# Altium schematic sheet Total.SchDoc: USRP Cellular Tranceiver
size A3; Revision: 1; SheetNumber: 1; DocumentName: Fairwaves Co.
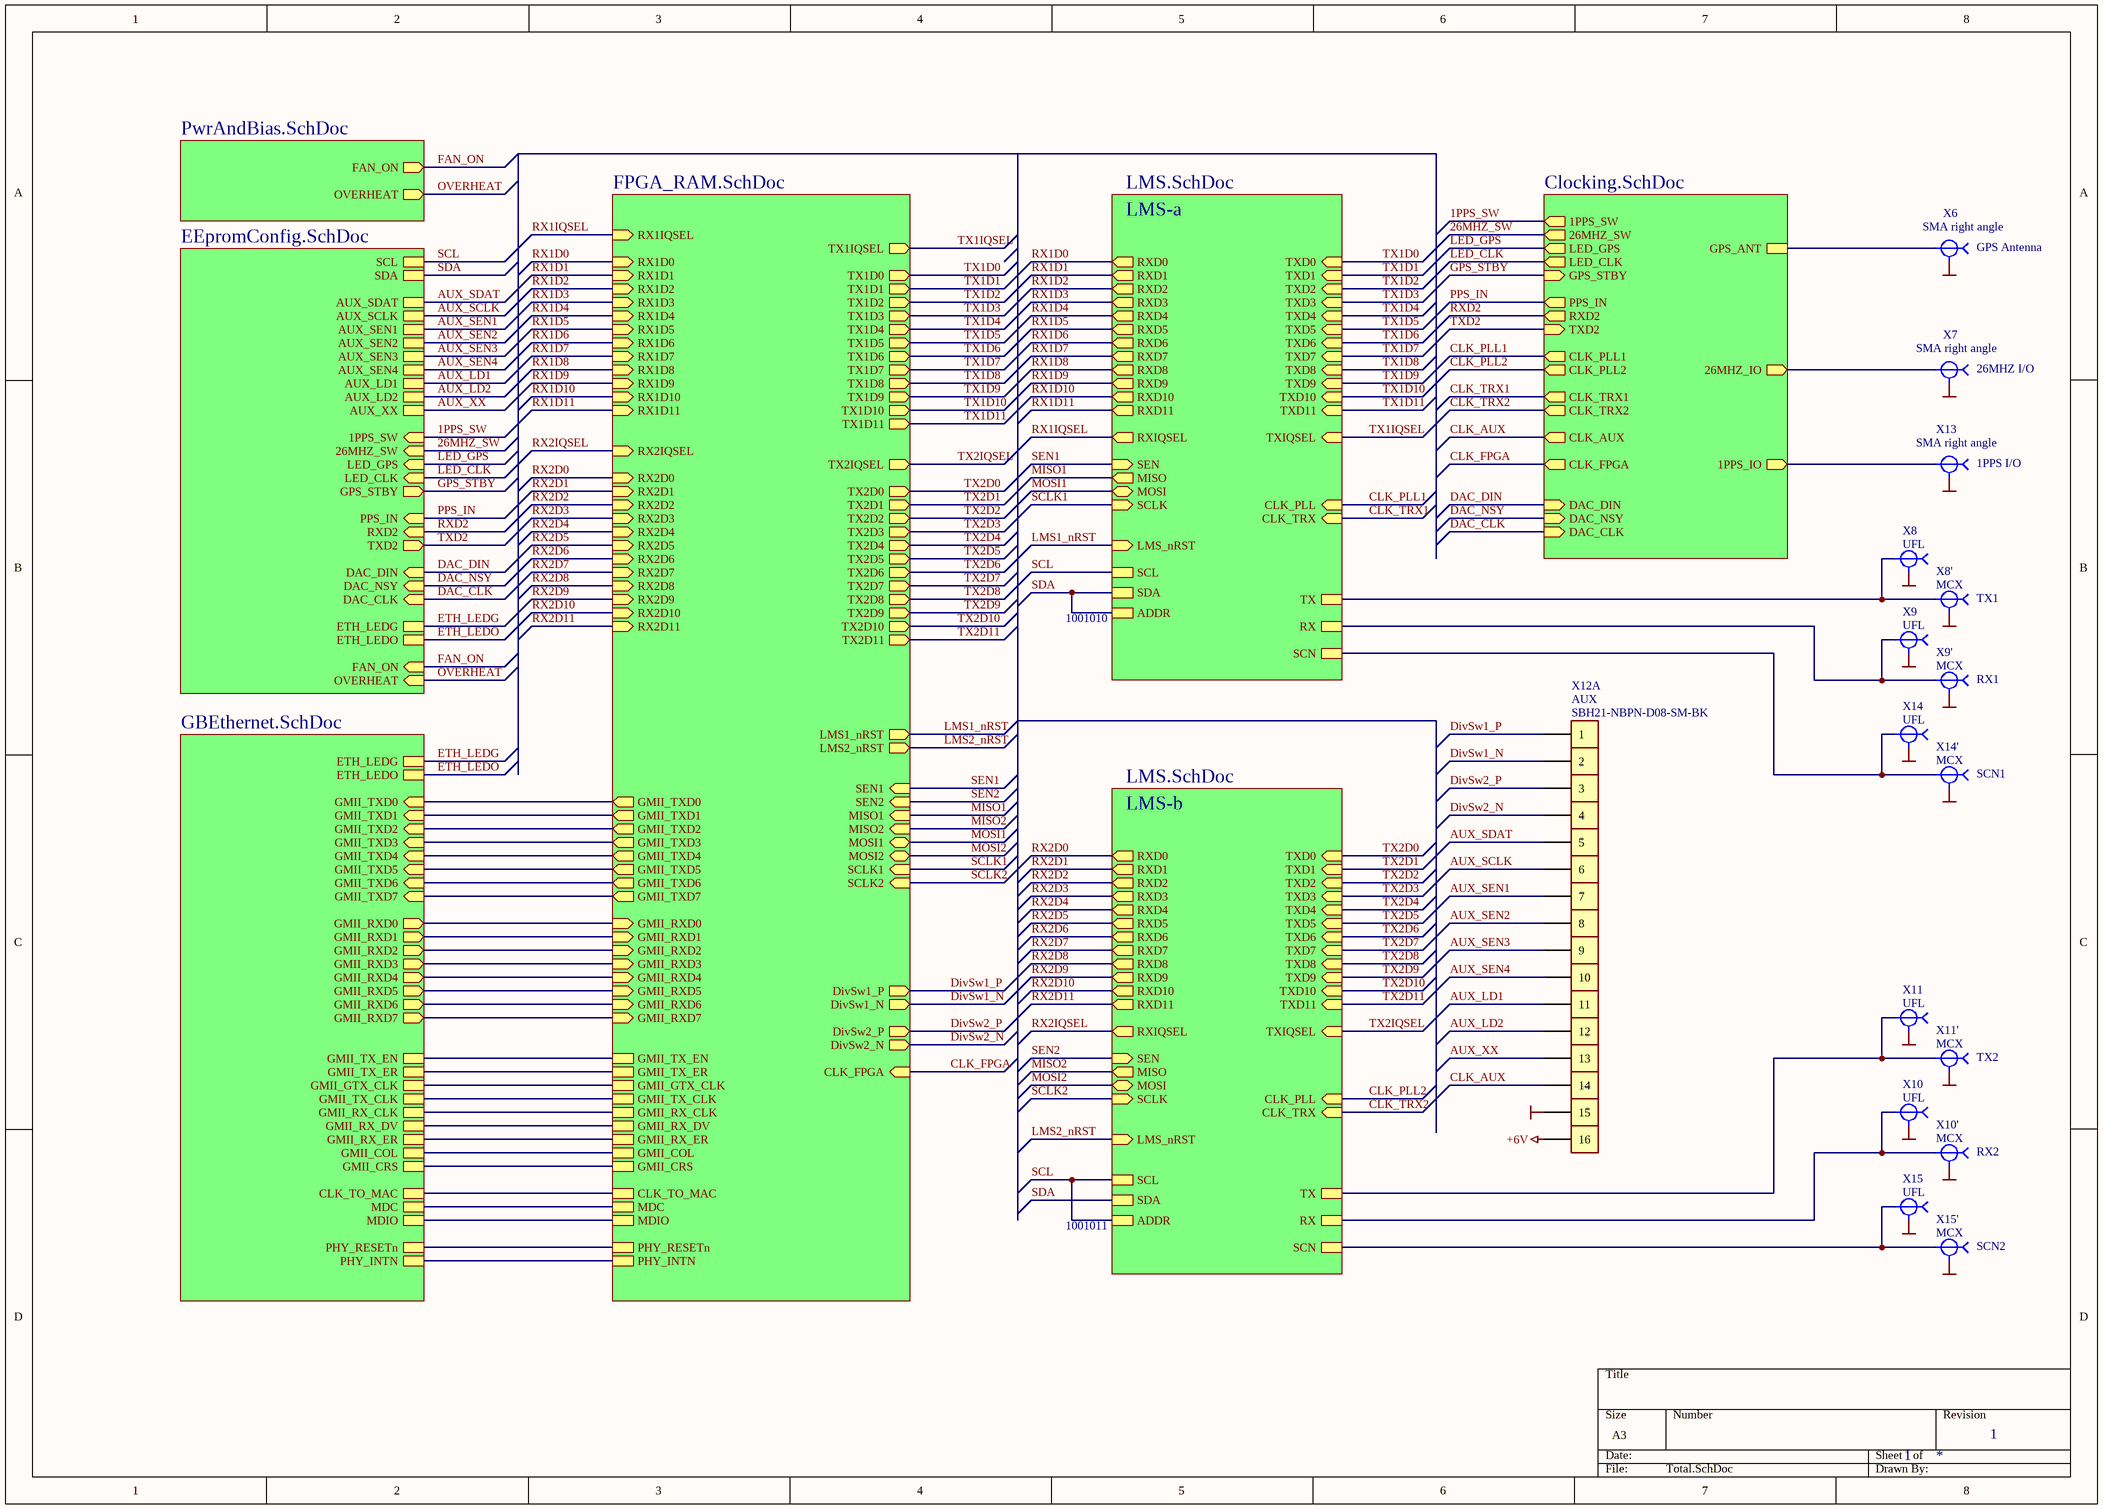
[diagram p0: Total.SchDoc]

## Parts
X6  SMA right angle  Description: GPS Antenna  [SMA right angle]
X7  SMA right angle  Description: 26MHZ I/O  [SMA right angle]
X8  UFL  [U_FL]
X8'  MCX  Discription: TX1  [ML 120]
X9  UFL  [U_FL]
X9'  MCX  Discription: RX1  [ML 120]
X10  UFL  [U_FL]
X10'  MCX  Discription: RX2  [ML 120]
X11  UFL  [U_FL]
X11'  MCX  Discription: TX2  [ML 120]
X12  SBH21-NBPN-D08-SM-BK  Misc: AUX  [SBH-16]  (parts A,B,C,D,E,F,G,H,I,J,K,L,M,N,O,P of 16)
X13  SMA right angle  Description: 1PPS I/O  [SMA right angle]
X14  UFL  [U_FL]
X14'  MCX  Discription: SCN1  [ML 120]
X15  UFL  [U_FL]
X15'  MCX  Discription: SCN2  [ML 120]

## Sub-sheets
Clocking = Clocking.SchDoc: TXD2 (in), 26MHZ_IO (out), CLK_FPGA (out), CLK_TRX1 (out), GPS_ANT, DAC_DIN (in), DAC_NSY (in), DAC_CLK (in), PPS_IN (out), RXD2 (out), CLK_PLL1 (out), CLK_AUX (out), 1PPS_IO (out), CLK_PLL2 (out), CLK_TRX2 (out), 1PPS_SW (out), 26MHZ_SW (out), LED_GPS (out), LED_CLK (out), GPS_STBY (in)
EEpromConfig = EEpromConfig.SchDoc: PPS_IN (in), DAC_DIN (in), DAC_NSY (in), DAC_CLK (in), TXD2 (out), RXD2 (in), ETH_LEDG, ETH_LEDO, FAN_ON (in), OVERHEAT (in), AUX_SDAT, AUX_SCLK, AUX_SEN1, AUX_LD1, AUX_XX, AUX_SEN2, AUX_LD2, 1PPS_SW (in), 26MHZ_SW (in), LED_GPS (in), LED_CLK (in), AUX_SEN3, AUX_SEN4, GPS_STBY (out), SCL, SDA
FPGA_RAM = FPGA_RAM.SchDoc: DivSw1_P (out), DivSw1_N (out), TX1IQSEL (out), TX2IQSEL (out), RX1IQSEL (in), RX2IQSEL (in), SEN1 (in), SEN2 (in), MISO1 (in), MOSI1 (bidir), SCLK1 (in), DivSw2_P (out), DivSw2_N (out), CLK_FPGA (in), CLK_TO_MAC, GMII_TX_EN, GMII_TX_ER, GMII_GTX_CLK, GMII_TX_CLK, GMII_RX_CLK, GMII_RX_DV, GMII_RX_ER, GMII_COL, GMII_CRS, MDIO, MDC, PHY_INTN, PHY_RESETn, MISO2 (in), MOSI2 (bidir), SCLK2 (in), LMS1_nRST (out), LMS2_nRST (out), TX1D0 (out), TX1D1 (out), TX1D2 (out), TX1D3 (out), TX1D4 (out), TX1D5 (out), TX1D6 (out), TX1D7 (out), TX1D8 (out), TX1D9 (out), TX1D10 (out), TX1D11 (out), TX2D0 (out), TX2D1 (out), TX2D2 (out), TX2D3 (out), TX2D4 (out), TX2D5 (out), TX2D6 (out), TX2D7 (out), TX2D8 (out), TX2D9 (out), TX2D10 (out), TX2D11 (out), RX1D0 (in), RX1D1 (in), RX1D2 (in), RX1D3 (in), RX1D4 (in), RX1D5 (in), RX1D6 (in), RX1D7 (in), RX1D8 (in), RX1D9 (in), RX1D10 (in), RX1D11 (in), RX2D0 (in), RX2D1 (in), RX2D2 (in), RX2D3 (in), RX2D4 (in), RX2D5 (in), RX2D6 (in), RX2D7 (in), RX2D8 (in), RX2D9 (in), RX2D10 (in), RX2D11 (in), GMII_TXD0 (out), GMII_TXD1 (out), GMII_TXD2 (out), GMII_TXD3 (out), GMII_TXD4 (out), GMII_TXD5 (out), GMII_TXD6 (out), GMII_TXD7 (out), GMII_RXD0 (in), GMII_RXD1 (in), GMII_RXD2 (in), GMII_RXD3 (in), GMII_RXD4 (in), GMII_RXD5 (in), GMII_RXD6 (in), GMII_RXD7 (in)
GBEthernet = GBEthernet.SchDoc: CLK_TO_MAC, GMII_TX_ER, GMII_TX_EN, GMII_GTX_CLK, GMII_RX_CLK, GMII_TX_CLK, GMII_RX_DV, GMII_RX_ER, GMII_COL, GMII_CRS, MDC, MDIO, PHY_INTN, PHY_RESETn, ETH_LEDG, GMII_TXD0 (in), GMII_TXD1 (in), GMII_TXD2 (in), GMII_TXD3 (in), GMII_TXD4 (in), GMII_TXD5 (in), GMII_TXD6 (in), GMII_TXD7 (in), GMII_RXD0 (out), GMII_RXD1 (out), GMII_RXD2 (out), GMII_RXD3 (out), GMII_RXD4 (out), GMII_RXD5 (out), GMII_RXD6 (out), GMII_RXD7 (out), ETH_LEDO
LMS-a = LMS.SchDoc: RXD0 (out), RXIQSEL (out), SEN (in), MISO (out), MOSI (bidir), SCLK (in), RXD1 (out), RXD2 (out), RXD3 (out), RXD4 (out), RXD5 (out), RXD6 (out), RXD7 (out), RXD8 (out), RXD9 (out), RXD10 (out), RXD11 (out), TXD0 (in), TXIQSEL (in), CLK_PLL (in), TXD1 (in), TXD2 (in), TXD3 (in), TXD4 (in), TXD5 (in), TXD6 (in), TXD7 (in), TXD8 (in), TXD9 (in), TXD10 (in), TXD11 (in), TX, RX, LMS_nRST (in), SCN, CLK_TRX (in), SCL, SDA, ADDR
LMS-b = LMS.SchDoc: RXD0 (out), RXIQSEL (out), SEN (in), MISO (out), MOSI (bidir), SCLK (in), RXD1 (out), RXD2 (out), RXD3 (out), RXD4 (out), RXD5 (out), RXD6 (out), RXD7 (out), RXD8 (out), RXD9 (out), RXD10 (out), RXD11 (out), TXD0 (in), TXIQSEL (in), CLK_PLL (in), TXD1 (in), TXD2 (in), TXD3 (in), TXD4 (in), TXD5 (in), TXD6 (in), TXD7 (in), TXD8 (in), TXD9 (in), TXD10 (in), TXD11 (in), TX, RX, LMS_nRST (in), CLK_TRX (in), SCN, SCL, SDA, ADDR
PwrAndBias = PwrAndBias.SchDoc: FAN_ON (out), OVERHEAT (out)

## Nets
+6V: X12.16
GND: X6.2(GND) X7.2(GND) X8.2(GND) X8'.2(GND) X9.2(GND) X9'.2(GND) X10.2(GND) X10'.2(GND) X11.2(GND) X11'.2(GND) X12.15 X13.2(GND) X14.2(GND) X14'.2(GND) X15.2(GND) X15'.2(GND)
1PPS_SW: sheet EEpromConfig/1PPS_SW, sheet Clocking/1PPS_SW
26MHZ_SW: sheet EEpromConfig/26MHZ_SW, sheet Clocking/26MHZ_SW
AUX_LD1: X12.11 ; sheet EEpromConfig/AUX_LD1
AUX_LD2: X12.12 ; sheet EEpromConfig/AUX_LD2
AUX_SCLK: X12.6 ; sheet EEpromConfig/AUX_SCLK
AUX_SDAT: X12.5 ; sheet EEpromConfig/AUX_SDAT
AUX_SEN1: X12.7 ; sheet EEpromConfig/AUX_SEN1
AUX_SEN2: X12.8 ; sheet EEpromConfig/AUX_SEN2
AUX_SEN3: X12.9 ; sheet EEpromConfig/AUX_SEN3
AUX_SEN4: X12.10 ; sheet EEpromConfig/AUX_SEN4
AUX_XX: X12.13 ; sheet EEpromConfig/AUX_XX
CLK_AUX: X12.14 ; sheet Clocking/CLK_AUX
CLK_FPGA: sheet FPGA_RAM/CLK_FPGA, sheet Clocking/CLK_FPGA
CLK_PLL1: sheet Clocking/CLK_PLL1, sheet LMS-a/CLK_PLL
CLK_PLL2: sheet Clocking/CLK_PLL2, sheet LMS-b/CLK_PLL
CLK_TRX1: sheet Clocking/CLK_TRX1, sheet LMS-a/CLK_TRX
CLK_TRX2: sheet Clocking/CLK_TRX2, sheet LMS-b/CLK_TRX
DAC_CLK: sheet EEpromConfig/DAC_CLK, sheet Clocking/DAC_CLK
DAC_DIN: sheet EEpromConfig/DAC_DIN, sheet Clocking/DAC_DIN
DAC_NSY: sheet EEpromConfig/DAC_NSY, sheet Clocking/DAC_NSY
DivSw1_N: X12.2 ; sheet FPGA_RAM/DivSw1_N
DivSw1_P: X12.1 ; sheet FPGA_RAM/DivSw1_P
DivSw2_N: X12.4 ; sheet FPGA_RAM/DivSw2_N
DivSw2_P: X12.3 ; sheet FPGA_RAM/DivSw2_P
ETH_LEDG: sheet GBEthernet/ETH_LEDG, sheet EEpromConfig/ETH_LEDG
ETH_LEDO: sheet GBEthernet/ETH_LEDO, sheet EEpromConfig/ETH_LEDO
FAN_ON: sheet PwrAndBias/FAN_ON, sheet EEpromConfig/FAN_ON
GPS_STBY: sheet EEpromConfig/GPS_STBY, sheet Clocking/GPS_STBY
LED_CLK: sheet EEpromConfig/LED_CLK, sheet Clocking/LED_CLK
LED_GPS: sheet EEpromConfig/LED_GPS, sheet Clocking/LED_GPS
LMS1_nRST: sheet FPGA_RAM/LMS1_nRST, sheet LMS-a/LMS_nRST
LMS2_nRST: sheet FPGA_RAM/LMS2_nRST, sheet LMS-b/LMS_nRST
MISO1: sheet FPGA_RAM/MISO1, sheet LMS-a/MISO
MISO2: sheet FPGA_RAM/MISO2, sheet LMS-b/MISO
MOSI1: sheet FPGA_RAM/MOSI1, sheet LMS-a/MOSI
MOSI2: sheet FPGA_RAM/MOSI2, sheet LMS-b/MOSI
OVERHEAT: sheet PwrAndBias/OVERHEAT, sheet EEpromConfig/OVERHEAT
PPS_IN: sheet EEpromConfig/PPS_IN, sheet Clocking/PPS_IN
RX1D0: sheet FPGA_RAM/RX1D0, sheet LMS-a/RXD0
RX1D1: sheet FPGA_RAM/RX1D1, sheet LMS-a/RXD1
RX1D2: sheet FPGA_RAM/RX1D2, sheet LMS-a/RXD2
RX1D3: sheet FPGA_RAM/RX1D3, sheet LMS-a/RXD3
RX1D4: sheet FPGA_RAM/RX1D4, sheet LMS-a/RXD4
RX1D5: sheet FPGA_RAM/RX1D5, sheet LMS-a/RXD5
RX1D6: sheet FPGA_RAM/RX1D6, sheet LMS-a/RXD6
RX1D7: sheet FPGA_RAM/RX1D7, sheet LMS-a/RXD7
RX1D8: sheet FPGA_RAM/RX1D8, sheet LMS-a/RXD8
RX1D9: sheet FPGA_RAM/RX1D9, sheet LMS-a/RXD9
RX1D10: sheet FPGA_RAM/RX1D10, sheet LMS-a/RXD10
RX1D11: sheet FPGA_RAM/RX1D11, sheet LMS-a/RXD11
RX1IQSEL: sheet FPGA_RAM/RX1IQSEL, sheet LMS-a/RXIQSEL
RX2D0: sheet FPGA_RAM/RX2D0, sheet LMS-b/RXD0
RX2D1: sheet FPGA_RAM/RX2D1, sheet LMS-b/RXD1
RX2D2: sheet FPGA_RAM/RX2D2, sheet LMS-b/RXD2
RX2D3: sheet FPGA_RAM/RX2D3, sheet LMS-b/RXD3
RX2D4: sheet FPGA_RAM/RX2D4, sheet LMS-b/RXD4
RX2D5: sheet FPGA_RAM/RX2D5, sheet LMS-b/RXD5
RX2D6: sheet FPGA_RAM/RX2D6, sheet LMS-b/RXD6
RX2D7: sheet FPGA_RAM/RX2D7, sheet LMS-b/RXD7
RX2D8: sheet FPGA_RAM/RX2D8, sheet LMS-b/RXD8
RX2D9: sheet FPGA_RAM/RX2D9, sheet LMS-b/RXD9
RX2D10: sheet FPGA_RAM/RX2D10, sheet LMS-b/RXD10
RX2D11: sheet FPGA_RAM/RX2D11, sheet LMS-b/RXD11
RX2IQSEL: sheet FPGA_RAM/RX2IQSEL, sheet LMS-b/RXIQSEL
RXD2: sheet EEpromConfig/RXD2, sheet Clocking/RXD2
SCL: sheet EEpromConfig/SCL, sheet LMS-a/SCL, sheet LMS-b/SCL, sheet LMS-b/ADDR
SCLK1: sheet FPGA_RAM/SCLK1, sheet LMS-a/SCLK
SCLK2: sheet FPGA_RAM/SCLK2, sheet LMS-b/SCLK
SDA: sheet EEpromConfig/SDA, sheet LMS-a/SDA, sheet LMS-a/ADDR, sheet LMS-b/SDA
SEN1: sheet FPGA_RAM/SEN1, sheet LMS-a/SEN
SEN2: sheet FPGA_RAM/SEN2, sheet LMS-b/SEN
TX1D0: sheet FPGA_RAM/TX1D0, sheet LMS-a/TXD0
TX1D1: sheet FPGA_RAM/TX1D1, sheet LMS-a/TXD1
TX1D2: sheet FPGA_RAM/TX1D2, sheet LMS-a/TXD2
TX1D3: sheet FPGA_RAM/TX1D3, sheet LMS-a/TXD3
TX1D4: sheet FPGA_RAM/TX1D4, sheet LMS-a/TXD4
TX1D5: sheet FPGA_RAM/TX1D5, sheet LMS-a/TXD5
TX1D6: sheet FPGA_RAM/TX1D6, sheet LMS-a/TXD6
TX1D7: sheet FPGA_RAM/TX1D7, sheet LMS-a/TXD7
TX1D8: sheet FPGA_RAM/TX1D8, sheet LMS-a/TXD8
TX1D9: sheet FPGA_RAM/TX1D9, sheet LMS-a/TXD9
TX1D10: sheet FPGA_RAM/TX1D10, sheet LMS-a/TXD10
TX1D11: sheet FPGA_RAM/TX1D11, sheet LMS-a/TXD11
TX1IQSEL: sheet FPGA_RAM/TX1IQSEL, sheet LMS-a/TXIQSEL
TX2D0: sheet FPGA_RAM/TX2D0, sheet LMS-b/TXD0
TX2D1: sheet FPGA_RAM/TX2D1, sheet LMS-b/TXD1
TX2D2: sheet FPGA_RAM/TX2D2, sheet LMS-b/TXD2
TX2D3: sheet FPGA_RAM/TX2D3, sheet LMS-b/TXD3
TX2D4: sheet FPGA_RAM/TX2D4, sheet LMS-b/TXD4
TX2D5: sheet FPGA_RAM/TX2D5, sheet LMS-b/TXD5
TX2D6: sheet FPGA_RAM/TX2D6, sheet LMS-b/TXD6
TX2D7: sheet FPGA_RAM/TX2D7, sheet LMS-b/TXD7
TX2D8: sheet FPGA_RAM/TX2D8, sheet LMS-b/TXD8
TX2D9: sheet FPGA_RAM/TX2D9, sheet LMS-b/TXD9
TX2D10: sheet FPGA_RAM/TX2D10, sheet LMS-b/TXD10
TX2D11: sheet FPGA_RAM/TX2D11, sheet LMS-b/TXD11
TX2IQSEL: sheet FPGA_RAM/TX2IQSEL, sheet LMS-b/TXIQSEL
TXD2: sheet EEpromConfig/TXD2, sheet Clocking/TXD2
NetX6_1: X6.1 ; sheet Clocking/GPS_ANT
NetX7_1: X7.1 ; sheet Clocking/26MHZ_IO
NetX8_1: X8.1 X8'.1 ; sheet LMS-a/TX
NetX9_1: X9.1 X9'.1 ; sheet LMS-a/RX
NetX10_1: X10.1 X10'.1 ; sheet LMS-b/RX
NetX11_1: X11.1 X11'.1 ; sheet LMS-b/TX
NetX13_1: X13.1 ; sheet Clocking/1PPS_IO
NetX14_1: X14.1 X14'.1 ; sheet LMS-a/SCN
NetX15_1: X15.1 X15'.1 ; sheet LMS-b/SCN
(unnamed): sheet FPGA_RAM/CLK_TO_MAC, sheet GBEthernet/CLK_TO_MAC
(unnamed): sheet FPGA_RAM/GMII_TX_EN, sheet GBEthernet/GMII_TX_EN
(unnamed): sheet FPGA_RAM/GMII_TX_ER, sheet GBEthernet/GMII_TX_ER
(unnamed): sheet FPGA_RAM/GMII_GTX_CLK, sheet GBEthernet/GMII_GTX_CLK
(unnamed): sheet FPGA_RAM/GMII_TX_CLK, sheet GBEthernet/GMII_TX_CLK
(unnamed): sheet FPGA_RAM/GMII_RX_CLK, sheet GBEthernet/GMII_RX_CLK
(unnamed): sheet FPGA_RAM/GMII_RX_DV, sheet GBEthernet/GMII_RX_DV
(unnamed): sheet FPGA_RAM/GMII_RX_ER, sheet GBEthernet/GMII_RX_ER
(unnamed): sheet FPGA_RAM/GMII_COL, sheet GBEthernet/GMII_COL
(unnamed): sheet FPGA_RAM/GMII_CRS, sheet GBEthernet/GMII_CRS
(unnamed): sheet FPGA_RAM/MDIO, sheet GBEthernet/MDIO
(unnamed): sheet FPGA_RAM/MDC, sheet GBEthernet/MDC
(unnamed): sheet FPGA_RAM/PHY_INTN, sheet GBEthernet/PHY_INTN
(unnamed): sheet FPGA_RAM/PHY_RESETn, sheet GBEthernet/PHY_RESETn
(unnamed): sheet FPGA_RAM/GMII_TXD0, sheet GBEthernet/GMII_TXD0
(unnamed): sheet FPGA_RAM/GMII_TXD1, sheet GBEthernet/GMII_TXD1
(unnamed): sheet FPGA_RAM/GMII_TXD2, sheet GBEthernet/GMII_TXD2
(unnamed): sheet FPGA_RAM/GMII_TXD3, sheet GBEthernet/GMII_TXD3
(unnamed): sheet FPGA_RAM/GMII_TXD4, sheet GBEthernet/GMII_TXD4
(unnamed): sheet FPGA_RAM/GMII_TXD5, sheet GBEthernet/GMII_TXD5
(unnamed): sheet FPGA_RAM/GMII_TXD6, sheet GBEthernet/GMII_TXD6
(unnamed): sheet FPGA_RAM/GMII_TXD7, sheet GBEthernet/GMII_TXD7
(unnamed): sheet FPGA_RAM/GMII_RXD0, sheet GBEthernet/GMII_RXD0
(unnamed): sheet FPGA_RAM/GMII_RXD1, sheet GBEthernet/GMII_RXD1
(unnamed): sheet FPGA_RAM/GMII_RXD2, sheet GBEthernet/GMII_RXD2
(unnamed): sheet FPGA_RAM/GMII_RXD3, sheet GBEthernet/GMII_RXD3
(unnamed): sheet FPGA_RAM/GMII_RXD4, sheet GBEthernet/GMII_RXD4
(unnamed): sheet FPGA_RAM/GMII_RXD5, sheet GBEthernet/GMII_RXD5
(unnamed): sheet FPGA_RAM/GMII_RXD6, sheet GBEthernet/GMII_RXD6
(unnamed): sheet FPGA_RAM/GMII_RXD7, sheet GBEthernet/GMII_RXD7

## Notes on the sheet
- 1001010
- 1001011

## Library data of the parts
X6 X7 X13 = SMA-Right Angle: Разъем; Name: SMA right angle
X8-X11 X14 X15 = U_FL: Ultraminiature Coax Connector (UMCC); Manufacturer: Tyco Electronics Corp; Dscription: GPS ANT; Name: UFL
X8' X9' X10' X11' X14' X15' = MCX SM: Manufacturer: Tyco Electronics Corp; Name: MCX
X12 = SBH21-8x2_SMD: Connector 2mm SMD; Manufacturer: Sullins; Name: SBH21-NBPN-D08-SM-BK